# Altium schematic sheet UTC.SchDoc
size A2
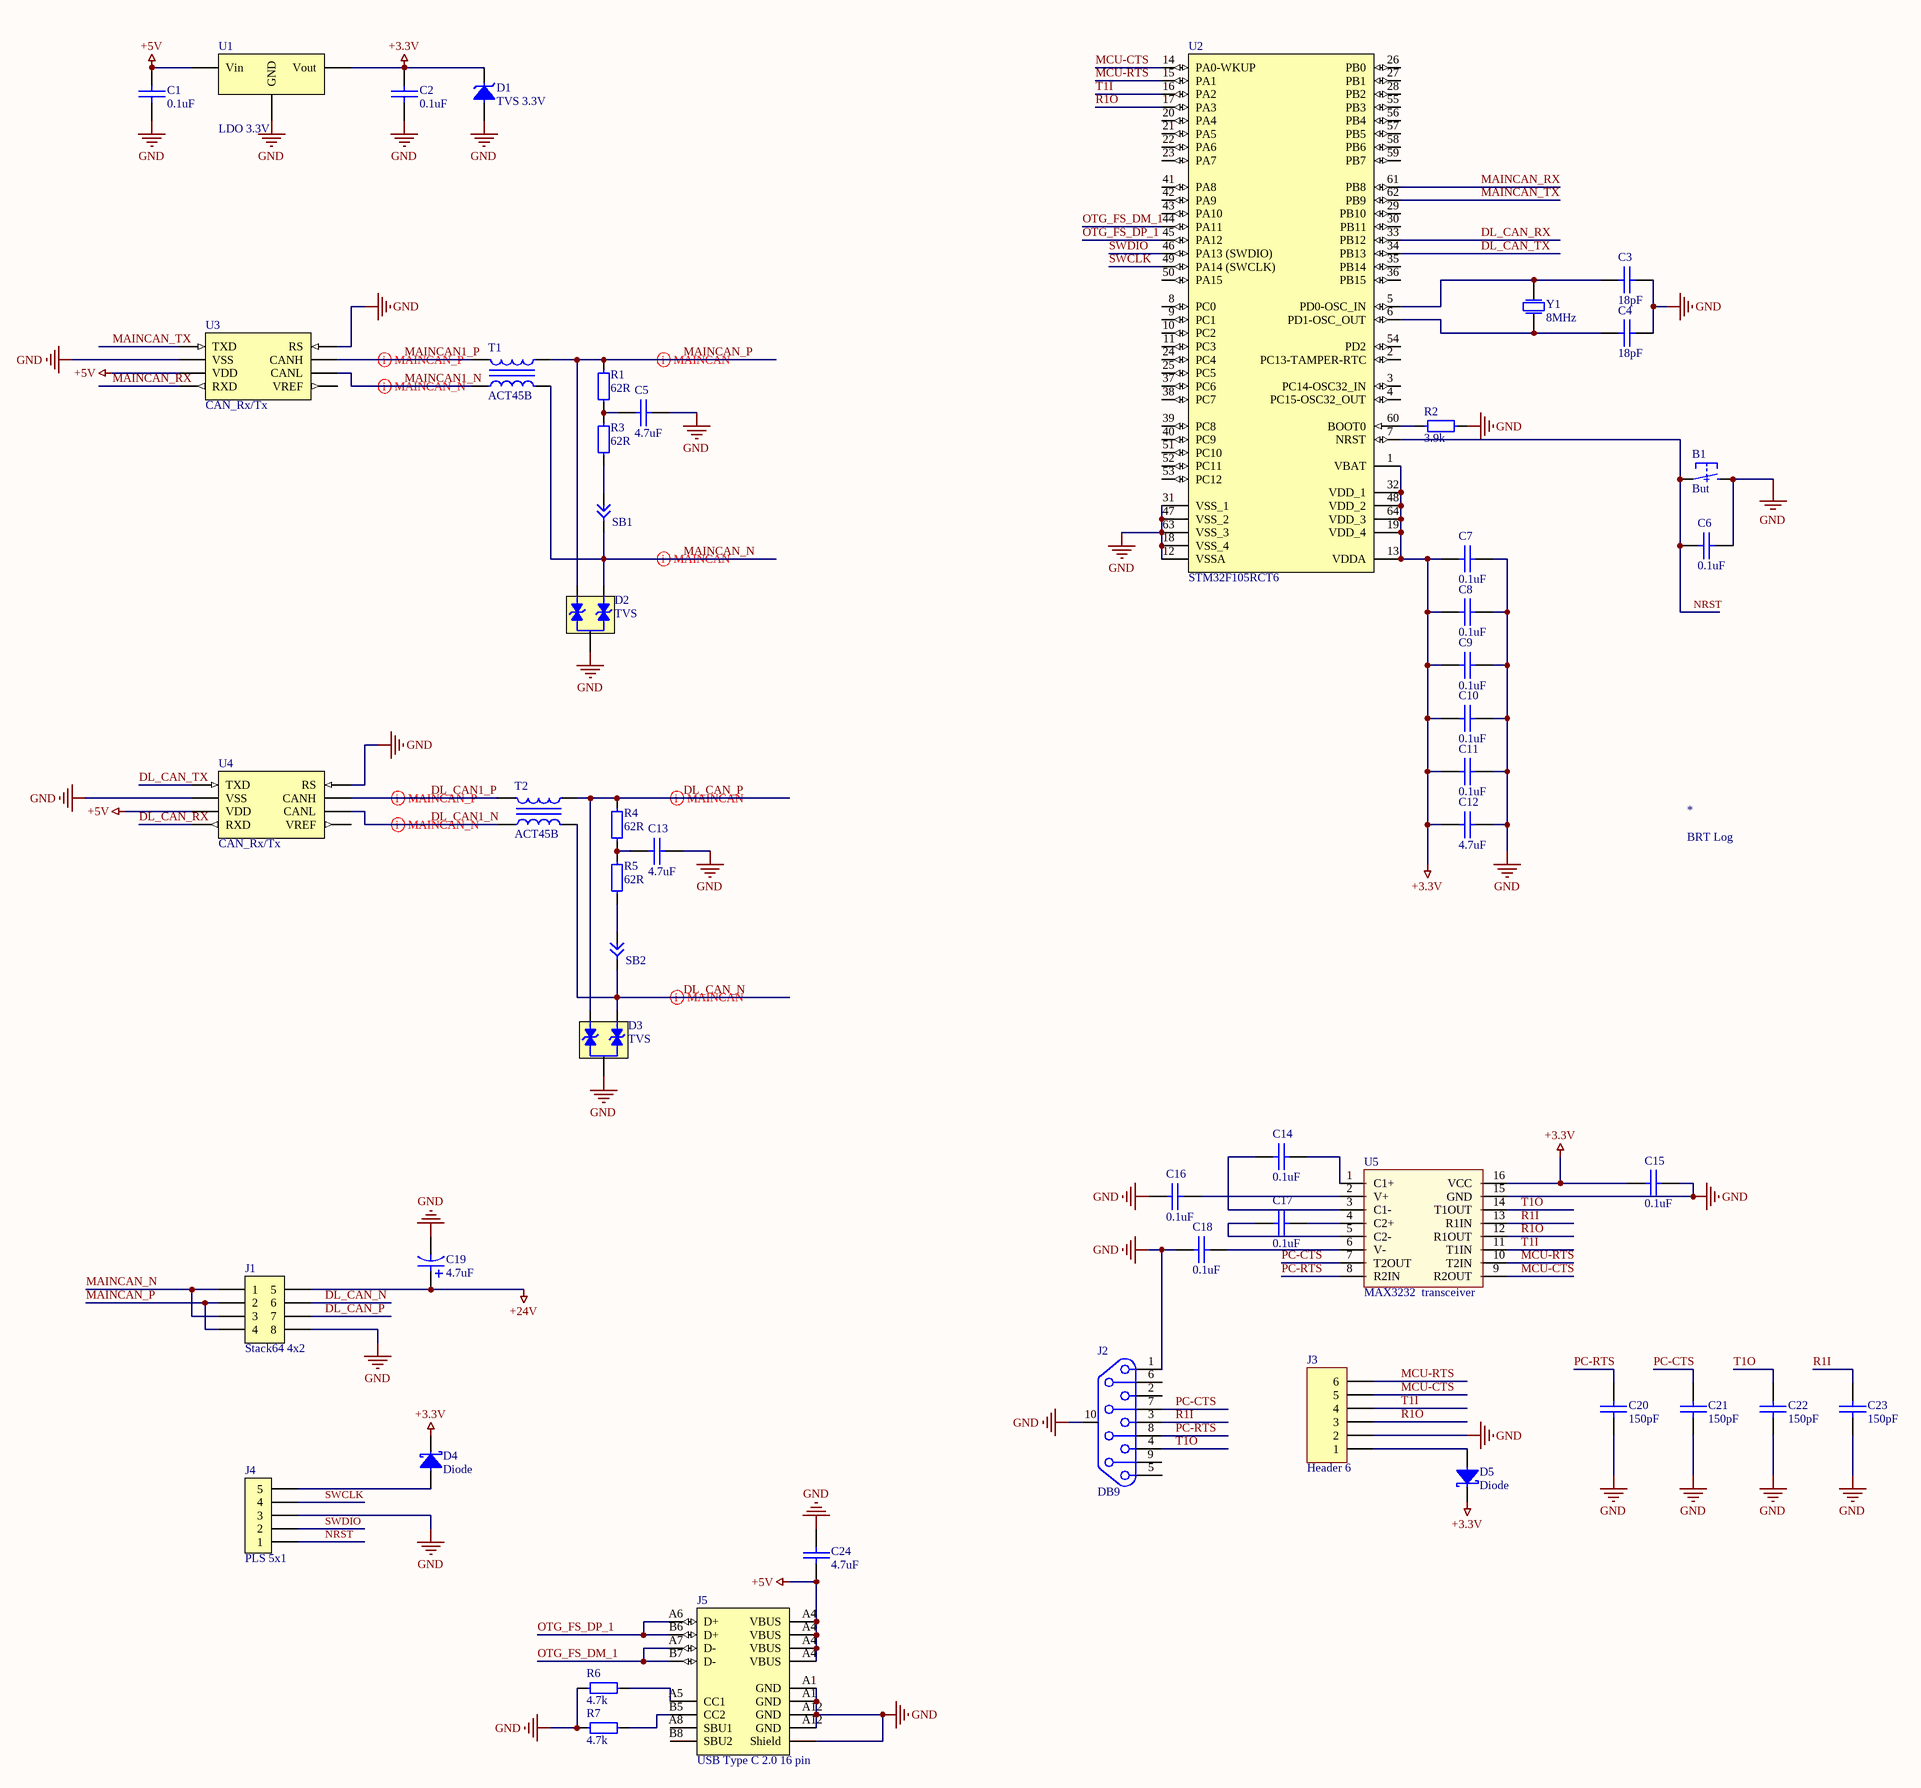
[diagram p0: UTC.SchDoc]

## Parts
*  BRT Log  [BRT_Log]
B1  But  [BUTTON 6x3.5]
C1  0.1uF  [0603 Capicator]
C2  0.1uF  [0603 Capicator]
C3  18pF  [0805 Capicator]
C4  18pF  [0805 Capicator]
C5  4.7uF  [0603 Capicator]
C6  0.1uF  [0603 Capicator]
C7  0.1uF  [0603 Capicator]
C8  0.1uF  [0603 Capicator]
C9  0.1uF  [0603 Capicator]
C10  0.1uF  [0603 Capicator]
C11  0.1uF  [0603 Capicator]
C12  4.7uF  [0603 Capicator]
C13  4.7uF  [0603 Capicator]
C14  0.1uF  [0805 Capicator]
C15  0.1uF  [0805 Capicator]
C16  0.1uF  [0805 Capicator]
C17  0.1uF  [0805 Capicator]
C18  0.1uF  [0805 Capicator]
C19  4.7uF  [Bar Cap 4x5.4]
C20  150pF  [0805 Capicator]
C21  150pF  [0805 Capicator]
C22  150pF  [0805 Capicator]
C23  150pF  [0805 Capicator]
C24  4.7uF  [0603 Capicator]
D1  TVS 3.3V  [DO-216AA]
D2  TVS  [SOT-23]
D3  TVS  [SOT-23]
D4  Diode  [sod-123]
D5  Diode  [sod-123]
J1  Stack64 4x2  [Conn 4x2 (Molex)]
J2  DB9  [DB9]
J3  Header 6  [HDR1X6]
J4  PLS 5x1  [PLS 5x1]
J5  USB Type C 2.0 16 pin  [USB Type C 16pin]
R1  62R  [0603 Resistor]
R2  3.9k  [0805 Resistor]
R3  62R  [0603 Resistor]
R4  62R  [0603 Resistor]
R5  62R  [0603 Resistor]
R6  4.7k  [0603 Resistor]
R7  4.7k  [0603 Resistor]
SB1  Circuit Breaker  [SB 0603]  (value not drawn)
SB2  Circuit Breaker  [SB 0603]  (value not drawn)
T1  ACT45B  [ACT45B]
T2  ACT45B  [ACT45B]
U1  LDO 3.3V  [SOT-23]
U2  STM32F105RCT6  [LQFP64]
U3  CAN_Rx/Tx  [SOIC-8]
U4  CAN_Rx/Tx  [SOIC-8]
U5  MAX3232  transceiver  [TSSOP-16]
Y1  8MHz  [hc-49sm]

## Nets
+3.3V: C2.2 C7.1 C8.1 C9.1 C10.1 C11.1 C12.1 C15.1 D1.2 D4.2 D5.2 U1.2(Vout) U2.1(VBAT) U2.13(VDDA) U2.19(VDD_4) U2.32(VDD_1) U2.48(VDD_2) U2.64(VDD_3) U5.16(VCC)
+5V: C1.2 C24.2 J5.A4(VBUS) U1.3(Vin) U3.3(VDD) U4.3(VDD)
+24V: C19.2 J1.5
GND: B1.2 C1.1 C2.1 C3.2 C4.2 C5.1 C6.2 C7.2 C8.2 C9.2 C10.2 C11.2 C12.2 C13.1 C15.2 C16.1 C18.1 C19.1 C20.1 C21.1 C22.1 C23.2 C24.1 D1.1 D2.3 D3.3 J1.8 J2.1 J3.2 J4.3 J5.A(Shield) J5.A1(GND) J5.A12(GND) R2.2 R6.1 R7.1 U1.1(GND) U2.12(VSSA) U2.18(VSS_4) U2.31(VSS_1) U2.47(VSS_2) U2.63(VSS_3) U3.2(VSS) U3.8(RS) U4.2(VSS) U4.8(RS) U5.15(GND)
DL_CAN1_N: T2.2 U4.6(CANL)
DL_CAN1_P: T2.1 U4.7(CANH)
DL_CAN_N: D3.2 J1.6 SB2.1 T2.3
DL_CAN_P: D3.1 J1.7 R4.2 T2.4
DL_CAN_RX: U2.33(PB12) U4.4(RXD)
DL_CAN_TX: U2.34(PB13) U4.1(TXD)
MAINCAN1_N: T1.2 U3.6(CANL)
MAINCAN1_P: T1.1 U3.7(CANH)
MAINCAN_N: D2.2 J1.1 J1.3 SB1.1 T1.3
MAINCAN_P: D2.1 J1.2 J1.4 R1.2 T1.4
MAINCAN_RX: U2.61(PB8) U3.4(RXD)
MAINCAN_TX: U2.62(PB9) U3.1(TXD)
MCU-CTS: J3.5 U2.14(PA0-WKUP) U5.9(R2OUT)
MCU-RTS: J3.6 U2.15(PA1) U5.10(T2IN)
NRST: B1.1 C6.1 J4.1 U2.7(NRST)
OTG_FS_DM_1: J5.A7(D-) J5.B7(D-) U2.44(PA11)
OTG_FS_DP_1: J5.A6(D+) J5.B6(D+) U2.45(PA12)
PC-CTS: C21.2 J2.7 U5.7(T2OUT)
PC-RTS: C20.2 J2.8 U5.8(R2IN)
R1I: C23.1 J2.3 U5.13(R1IN)
R1O: J3.3 U2.17(PA3) U5.12(R1OUT)
SWCLK: J4.4 U2.49(PA14_(SWCLK))
SWDIO: J4.2 U2.46(PA13_(SWDIO))
T1I: J3.4 U2.16(PA2) U5.11(T1IN)
T1O: C22.2 J2.4 U5.14(T1OUT)
NetC3_1: C3.1 U2.5(PD0-OSC_IN) Y1.2
NetC4_1: C4.1 U2.6(PD1-OSC_OUT) Y1.1
NetC5_2: C5.2 R1.1 R3.2
NetC13_2: C13.2 R4.1 R5.2
NetC14_1: C14.1 U5.3(C1-)
NetC14_2: C14.2 U5.1(C1+)
NetC16_2: C16.2 U5.2(V+)
NetC17_1: C17.1 U5.5(C2-)
NetC17_2: C17.2 U5.4(C2+)
NetC18_2: C18.2 U5.6(V-)
NetD4_1: D4.1 J4.5
NetD5_1: D5.1 J3.1
NetJ5_A5: J5.A5(CC1) R6.2
NetJ5_B5: J5.B5(CC2) R7.2
NetR2_1: R2.1 U2.60(BOOT0)
NetR3_1: R3.1 SB1.2
NetR5_1: R5.1 SB2.2

Not connected (* = marked no-connect by the designer): J2 2 5 6 9 10(3); J5 A8(SBU1) B8(SBU2); U2 2(PC13-TAMPER-RTC) 3(PC14-OSC32_IN) 4(PC15-OSC32_OUT) 8(PC0) 9(PC1) 10(PC2) 11(PC3) 20(PA4) 21(PA5) 22(PA6) 23(PA7) 24(PC4) 25(PC5) 26(PB0) 27(PB1) 28(PB2) 29(PB10) 30(PB11) 35(PB14) 36(PB15) 37(PC6) 38(PC7) 39(PC8) 40(PC9) 41(PA8) 42(PA9) 43(PA10) 50(PA15) 51(PC10) 52(PC11) 53(PC12) 54(PD2) 55(PB3) 56(PB4) 57(PB5) 58(PB6) 59(PB7); U3 5(VREF); U4 5(VREF)

## Layout directives
differential pair: DL_CAN1_N, DL_CAN1_P, DL_CAN_N, DL_CAN_P, MAINCAN1_N, MAINCAN1_P, MAINCAN_N, MAINCAN_P

## Notes on the sheet
- Title
- Size:
- Date:
- File:
- A2
- Number:
- Time:
- Revision:
- Sheet
- of

## Library data of the parts
* = BRT Log: Team Logo
B1 = Button 2 Conn: Button 2 Conn SMD; Part Number: L-KLS7-TS3608-5.0-180; Manufacturer: KLS electronic co ltd; Type: Button; ComponentLink1Description: Chip&Dip; ComponentLink1URL: https://www.chipdip.ru/product/kls7-ts3608-5.0-180-td-02xa
C1 C2 C6-C11 = Cap 0.1uF (0603): 0.1uF X7R 16V 10% 0603; Manufacturer: Murata Manufacturing; Part Number: GRM188R71C104KA01D; Type: Capacitor; ComponentLink1Description: Chip&Dip; ComponentLink1URL: https://www.chipdip.ru/product/grm188r71c104ka01d
C3 C4 = Cap 18pF (0805): 18pF NP0 50V 5% 0805; Manufacturer: Murata Manufacturing; Part Number: GRM2165C1H180JD01D; Type: Capacitor; ComponentLink1Description: Chip&Dip; ComponentLink1URL: https://www.chipdip.ru/product/grm2165c1h180j
C5 C12 C13 C24 = Cap 4.7uF (0603): 4.7uF X5R 25V 10% 0603; Manufacturer: Murata Manufacturing; Part Number: GRM188R61E475KE11D; Type: Capacitor; ComponentLink1Description: Chip&Dip; ComponentLink1URL: https://www.chipdip.ru/product0/9000348448
C14-C18 = Cap 0.1uF (0805): 0.1uF X7R 25V 10% 0805; Manufacturer: Murata Manufacturing; Part Number: GRM21BR71E104KA01L; Type: Capacitor; ComponentLink1Description: Chip&Dip; ComponentLink1URL: https://www.chipdip.ru/product/grm21br71e104ka01l
C19 = Cap Pol 4.7uF: ECAP SMD,  35V, 105°C; Part Number: B41121A7475M000; Manufacturer: Epcos; Type: Capacitor; ComponentLink1Description: Chip&Dip; ComponentLink1URL: https://www.chipdip.ru/product/b41121a7475m000
C20-C23 = Cap 150pF (0805): 150pF NPO 5% 50V 0805; Manufacturer: Murata; Part Number: GRM2165C1H151JA01D; Type: Capacitor; ComponentLink1Description: Chip&Dip; ComponentLink1URL: https://www.chipdip.ru/product/grm2165c1h151j
D1 = TVS Diode 3.3V [SM2T]: High peak pulse power: 200 W (10/1000 μs); Part Number: SM2T3V3A; Manufacturer: STMicroelectronics; Type: Diode; ComponentLink1Description: DataSheet; ComponentLink1URL: https://www.st.com/resource/en/datasheet/sm2t3v3a.pdf; ComponentLink2Description: Chip&Dip; ComponentLink2URL: https://www.chipdip.ru/product0/8283670575
D2 D3 = TVS Diode Arrays: The SM24CANB TVS Diode Array is designed to protect automotive Controller Area Network (CAN) lines from damage due to electrostatic discharge (ESD), electrical fast transient (EFT), and other overvoltage transients.; Part Number: SM24CANB-02HTG; Manufacturer: Littelfuse; Type: Diode; ComponentLink1Description: DataSheet; ComponentLink1URL: https://m.littelfuse.com/~/media/electronics/datasheets/tvs_diode_arrays/littelfuse_tvs_diode_array_sm24canb_datasheet.pdf.pdf; ComponentLink2Description: Chip&Dip; ComponentLink2URL: https://www.chipdip.ru/product1/8001779022
D4 D5 = Diode Schottky (SOD-123): 0.5 A, Low Forward Voltage less than 385 mV, 400 mW Power Dissipation Package; Part Number: MBR0520L; Manufacturer: ON Semiconductor; Type: Diode; ComponentLink1Description: DataSheet; ComponentLink1URL: http://www.farnell.com/datasheets/1875336.pdf; ComponentLink2Description: Chip&Dip; ComponentLink2URL: https://www.chipdip.ru/product/mbr0520l
J1 = Conn 8 [Stack64]: Stac64 Right-Angle Header Assembly, 8 Circuits, Polarization A, Black, Tray; Manufacturer: Molex Electronic Solutions; Part Number: 346910080; Type: Connector; ComponentLink1Description: Molex; ComponentLink1URL: https://www.molex.com/molex/products/part-detail/pcb_headers/0346910080
J2 = Connector DB9: CONN D-SUB PLUG 9POS R/A SOLDER; Part Number: DR09S-H-CN; Manufacturer: Auk Contractors; ComponentLink1Description: DataSheet; ComponentLink1URL: https://static.chipdip.ru/lib/009/DOC004009535.pdf; ComponentLink2Description: Chip&Dip; ComponentLink2URL: https://www.chipdip.ru/product/dr09s-h-cn-drb-9fa-dbr-9f; Type: Connector
J3 = Header 6: Header, 6-Pin; LatestRevisionDate: 17-Jul-2002; LatestRevisionNote: Re-released for DXP Platform.; Publisher: Altium Limited
J4 = Conn 5 (PLS): Header, 5-Pin
R1 R3-R5 = Res 62R (0603): 0.1W 0603 62R, 1%; Part Number: RC0603FR-0762RL; Manufacturer: Taiwan; Type: Resistor; ComponentLink1Description: Chip&Dip; ComponentLink1URL: https://www.chipdip.ru/product0/9000079611
R2 = Res 3.9k (0805): 0.125W 0805 3.9k, 1%; Part Number: RC0805FR-073K9L; Manufacturer: Taiwan; Type: Resistor; ComponentLink1Description: Chip&Dip; ComponentLink1URL: https://www.chipdip.ru/product0/9000079500
R6 R7 = Res 4.7k (0603): 0.1W 0603 4.7k, 1%; Part Number: RC0603FR-074K7L; Manufacturer: Taiwan; Type: Resistor; ComponentLink1Description: Chip&Dip; ComponentLink1URL: https://www.chipdip.ru/product0/9000079728
T1 T2 = ACT45B: Common mode filters / Automotive signal line (for power train/safety); Manufacturer: EMC Components; Part Number: ACT45B-510-2P-TL003; Type: Inductor; ComponentLink1Description: DataSheet; ComponentLink1URL: https://product.tdk.com/info/en/catalog/datasheets/cmf_automotive_signal_act45b_en.pdf
U1 = LDO 3.3V [MCP]: A family of CMOS low dropout (LDO)voltage  regulators  that  can  deliver  up  to  250 mA  ofcurrent  while  consuming  only  1.6 μA  of  quiescentcurrent (typical). The input operating range is specifiedfrom 2.3V to 6.0V; Part Number: MCP1700T-3302E/TT; Manufacturer: Microchip; ComponentLink1Description: DataSheet; ComponentLink1URL: https://static.chipdip.ru/lib/276/DOC000276804.pdf; ComponentLink2Description: Chip&Dip; ComponentLink2URL: https://www.chipdip.ru/product/mcp1700t-3302e-tt; ComponentLink3Description: Elitan; ComponentLink3URL: https://www.elitan.ru/price/item595361
U2 = STM32F105RCT6: MCU ARM 256KB FLASH MEM 64-LQFP; Manufacturer: STMicroelectronics; Part Number: STM32F105RCT6; ComponentLink1Description: DataSheet; ComponentLink1URL: https://static6.arrow.com/aropdfconversion/3fd6bc01359f79a4f9745354b823e6b7c79e203b/2083962039691295cd00220364.pdf; ComponentLink2Description: Chip&Dip; ComponentLink2URL: https://www.chipdip.ru/product0/8001787632; Type: IC
U3 U4 = CAN Transceiver [MCP2551]: High-speed  CAN,  fault-tolerantdevice  that  serves  as  the  interface  between  a  CANprotocol controller and the physical bus.; Part Number: MCP2551-I/SN; Manufacturer: Microchip; ComponentLink1Description: DataSheet; ComponentLink1URL: https://static.chipdip.ru/lib/204/DOC000204457.pdf; ComponentLink2Description: Chip&Dip; ComponentLink2URL: https://www.chipdip.ru/product/mcp2551-i-sn; Type: IC
U5 = MAX 3232: RS-232 Dual Transmitters/Receivers, Maxim Integrated; Part Number: MAX3232CSE+T; Type: Transceiver; Manufacturer: Maxim; ComponentLink1Description: Chip&Dip; ComponentLink1URL: https://www.chipdip.ru/product/max3232cse; ComponentLink2Description: Datasheet; ComponentLink2URL: https://static.chipdip.ru/lib/222/DOC000222323.pdf
Y1 = Crystal 8MHz SMD: Crystal. HC-49SM (US); Manufacturer: China; Part Number: 8.000MHzHC-49SM; Type: Crystal; ComponentLink1Description: Chip&Dip; ComponentLink1URL: https://www.chipdip.ru/product/8mhz-hc-49sm